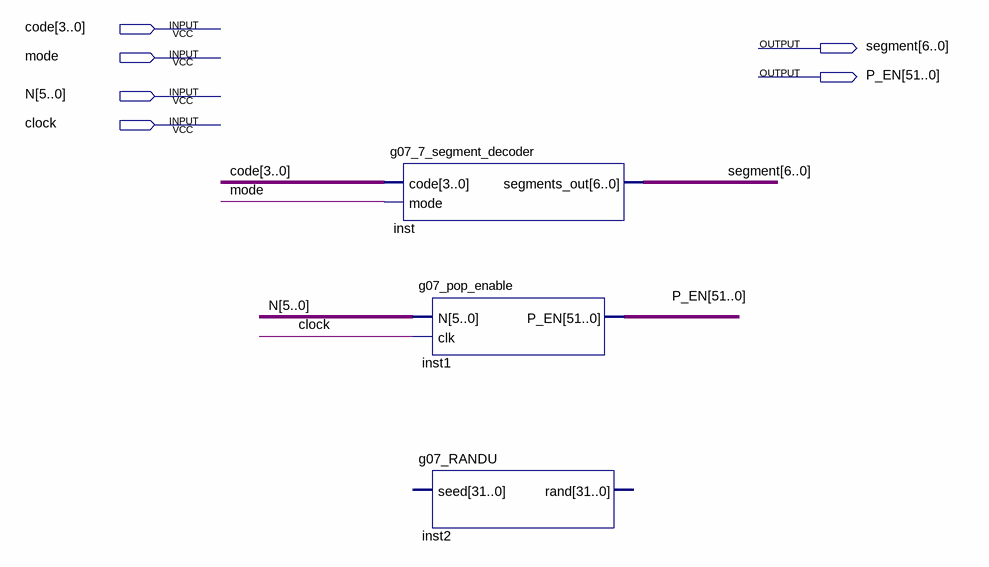
[diagram p0: schematic sheet]
// Quartus schematic g07_lab2.bdf as structural Verilog: 3 symbols, 6 pins
module g07_lab2 (
  input  [3:0] code,
  input  mode,
  input  [5:0] N,
  input  clock,
  output [6:0] segment,
  output [51:0] P_EN
);

  g07_7_segment_decoder inst (.code(code), .mode(mode), .segments_out(segment));
  g07_pop_enable inst1 (.N(N), .clk(clock), .P_EN(P_EN));
  g07_RANDU inst2 ();  // open: seed, rand
endmodule
